# Altium schematic sheet Power_Supply.SchDoc
size A4; SheetNumber: 5; SheetTotal: 5
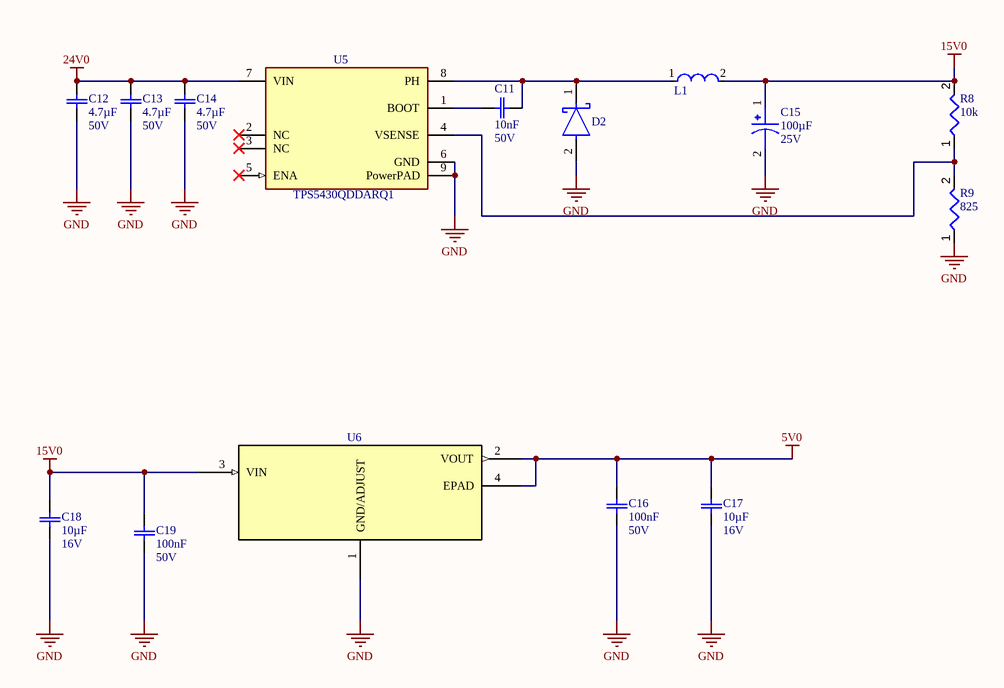
[diagram p0: Power_Supply.SchDoc]

## Parts
C11  value 10nF  Voltage Rating: 50V  [Generic Ceramic 0603 CAP]  (hidden comment: CAP-MLCC_SMD-0603_MR-GCM_n_10nF_50V_10%_COG)
C12  value 4.7µF  Voltage Rating: 50V  [Generic Ceramic 0805 CAP]  (hidden comment: CAP-MLCC_SMD-0805_TDK-CGA_u_4.7uF_V_10%_X8R)
C13  value 4.7µF  Voltage Rating: 50V  [Generic Ceramic 0805 CAP]  (hidden comment: CAP-MLCC_SMD-0805_TDK-CGA_u_4.7uF_V_10%_X8R)
C14  value 4.7µF  Voltage Rating: 50V  [Generic Ceramic 0805 CAP]  (hidden comment: CAP-MLCC_SMD-0805_TDK-CGA_u_4.7uF_V_10%_X8R)
C15  value 100µF  Voltage Rating: 25V  [FP-FKE-MFG]  (hidden comment: CAP_ELEC_SMD_PNS__EEE_u_100uF_25V_20%)
C16  value 100nF  Voltage Rating: 50V  [Generic Ceramic 0603 CAP]  (hidden comment: CAP-MLCC_SMD-0603_MR-GCM_u_0.1uF_50V_10%_X8L)
C17  value 10µF  Voltage Rating: 16V  [Generic Ceramic 0805 CAP]  (hidden comment: CAP-MLCC_SMD-0805_TDK-CGA_u_10uF_16V_20%_X7S)
C18  value 10µF  Voltage Rating: 16V  [Generic Ceramic 0805 CAP]  (hidden comment: CAP-MLCC_SMD-0805_TDK-CGA_u_10uF_16V_20%_X7S)
C19  value 100nF  Voltage Rating: 50V  [Generic Ceramic 0603 CAP]  (hidden comment: CAP-MLCC_SMD-0603_MR-GCM_u_0.1uF_50V_10%_X8L)
D2  MBRA340T3G  [ONSC-SMA-2-403D-02_F_V]  (value not drawn)
L1  SRR1260-150M  [FP-SRR1260-MFG]  (value not drawn)
R8  value 10k  [Generic_0603_RES]  (hidden comment: RES-TK_SMD-0603_VIS-CRCW_K_10K_1/10W_1%)
R9  value 825  [Generic_0603_RES]  (hidden comment: RES-TK_SMD-0603_VIS-CRCW_R_825R_1/10W_1%)
U5  TPS5430QDDARQ1  [FP-DDA0008J-IPC_B]
U6  AMS1117-5.0  [AMS1117-3.3-Footprint-1]  (value not drawn)

## Nets
5V0: C16.2 C17.2 U6.2(VOUT) U6.4(EPAD)
15V0: C15.1 C18.2 C19.2 L1.2 R8.2 U6.3(VIN)
24V0: C12.2 C13.2 C14.2 U5.7(VIN)
GND: C12.1 C13.1 C14.1 C15.2 C16.1 C17.1 C18.1 C19.1 D2.2(A) R9.1 U5.6(GND) U5.9(PowerPAD) U6.1(GND/ADJUST)
NetC11_1: C11.1 D2.1(C) L1.1 U5.8(PH)
NetC11_2: C11.2 U5.1(BOOT)
NetR8_1: R8.1 R9.2 U5.4(VSENSE)

Not connected (* = marked no-connect by the designer): U5 2(NC)* 3(NC)* 5(ENA)*

## Library data of the parts
C11 = CMP-001-00163-2: Ceramic Capacitor, Multilayer, Ceramic, 50V, 5% +Tol, 5% -Tol, C0G, 30ppm/Cel TC, 0.01uF, Surface Mount, 0603; Dielectric: COG; Max Operating Temperature: 125°C; Min Operating Temperature: -55°C; Mounting Technology: Surface Mount; Automotive: AEQ-200; Case/Package: 0603; RoHS Compliant: Yes; Capacitor Type: Ceramic; Pins: 2
C12-C14 = CMP-001-00158-2: Ceramic Capacitor, Multilayer, Ceramic, 50V, 10% +Tol, 10% -Tol, X5R, 15% TC, 4.7uF, Surface Mount, 0805; Tolerance: 10%; Max Operating Temperature: 85°C; Case/Package: 0805; RoHS Compliant: Yes; Automotive: AEQ-Q200; Mounting Technology: Surface Mount; Capacitor Type: Ceramic; Pins: 2; Dielectric: x5r; Min Operating Temperature: -55°C
C15 = CMP-001-00185-2: Aluminum Electrolytic Capacitor, Polarized, Aluminum (wet), 25V, 20% +Tol, 20% -Tol, 100uF, Surface Mount, 3333; Manufacturer Part Number: EEE-FK1H101GP; Ripple Current: 225mA; Capacitor Type: Aluminium; Case/Package: 3333; Min Operating Temperature: -55°C; Mounting Technology: Surface Mount; RoHS Compliant: Yes; Pins: 2; Max Operating Temperature: 105°C
C16 C19 = CMP-001-00115-11: Ceramic Capacitor, Multilayer, Ceramic, 50V, 10% +Tol, 10% -Tol, X8L, -40/+15% TC, 0.1uF, Surface Mount, 0603; Automotive: AEQ-200; Min Operating Temperature: -55°C; Case/Package: 0603; Mounting Technology: Surface Mount; RoHS Compliant: Yes; Capacitor Type: Ceramic; Pins: 2; Max Operating Temperature: 150°C
C17 C18 = CMP-001-00173-2: Ceramic Capacitor, Multilayer, Ceramic, 16V, 20% +Tol, 20% -Tol, X7S, 22% TC, 10uF, Surface Mount, 0805; RoHS Compliant: Yes; Capacitor Type: Ceramic; Tolerance: 20%; Pins: 2; Mounting Technology: SMD; Case/Package: 0805; Automotive: AEQ-Q200; Dielectric: X7S
D2 = CMP-001-0146-1: Diode, Schottky Barrier, Vr 40V, If 3A, Pkg SMA, Vf 0.45V, Tj +150degc, Cs 100A, Ir 15mA; Manufacturer Lifecycle Status: ACTIVE; Max Junction Temperature (Tj): 150°C; Number of Elements: 1; Forward Voltage: 450mV; Polarity: Standard; Peak Reverse Current: 300µA; Element Configuration: Single; REACH SVHC: No; Number of Terminals: 2; Width: 2.6mm; Min Operating Temperature: -55°C; Voltage Rating (DC): 40V; Reverse Standoff Voltage: 40V; Max Repetitive Reverse Voltage (Vrrm): 40V; Lifecycle Status: Production; Reverse Voltage: 40V; Output Current: 3A; Pins: 2; Lead Free: Lead Free; Max Reverse Voltage (DC): 40V; Max Forward Surge Current (Ifsm): 100A; Forward Current: 3A; Current Rating: 3A; Length: 4.32mm; Average Rectified Current: 3A; Radiation Hardening: No; Packaging: Tape and Reel; Max Operating Temperature: 150°C; Halogen Free: Halogen Free; China RoHS: Non-Compliant; Case/Package: SMA; RoHS: Compliant; Height: 2.2mm; Schedule B: 8541100080; Max Output current: 3A; Peak Non-Repetitive Surge Current: 100A
L1 = CMP-2000-07146-2: FIXED IND 15UH 5A 27 MOHM SMD; Q Factor: 25; Sample Rate (Hz): 100kHz; Resistance: 27MR; Material: Steel; Inductance Tolerance: 20%; Frequency: 17.6MHz; Saturation Current: 4.6A; Core Material: Ferrite; Shielding: Shielded; Series: SRR1260; Termination: SMD/SMT; Packaging: Tape and Reel; RoHS Compliant: Yes; Height - Seated (Max): 0.256inch; Depth: 12.8mm; Case/Package: 1260; Inductance: 15uH; Height: 6mm; Number of Pins: 2; Mount: Surface Mount; Min Operating Temperature: -40°C; Test Frequency: 100kHz; Length: 12.5mm; Self Resonant Frequency: 17.6MHz; Current Rating: 5A; Tolerance: 20%; RMS Current (Irms): 5A; REACH SVHC: No SVHC; Resistor Type: Wirewound; DC Resistance (DCR): 27mR; Width: 12.5mm; Package Quantity: 600; DC Current: 5A; Max DC Current: 5A; Max Operating Temperature: 125°C; Military Standard: Not
R8 = CMP-009-00231-2: Fixed Resistor, Metal Glaze/thick Film, 0.1W, 10000ohm, 75V, 1% +/-Tol, 100ppm/Cel, Surface Mount, 0603; Power: 100mW; Min Operating Temperature: -55°C; Case/Package: 0603; Max Operating Temperature: 155°C; RoHS Compliant: Yes; Voltage Rating: 75V; Tolerance: 1%; Pins: 2; Mounting Technology: Surface Mount
R9 = CMP-009-00203-6: Fixed Resistor, Metal Glaze/thick Film, 0.1W, 825ohm, 75V, 1% +/-Tol, 100ppm/Cel, Surface Mount, 0603; Power: 100mW; Case/Package: 0603; Min Operating Temperature: -55°C; Voltage Rating: 75V; Tolerance: 1%; Mounting Technology: Surface Mount; Pins: 2; Max Operating Temperature: 155°C; RoHS Compliant: Yes
U5 = CMP-001-0169-1: Automotive 5.5V to 36V, 500kHz Fixed Frequency 3A Buck Converter 8-SO PowerPAD -40 to 125; Manufacturer Lifecycle Status: ACTIVE; Output Voltage: 1.221V; Output Type: Adjustable; Quiescent Current: 3mA; Number of Outputs: 1; Max Duty Cycle: 89%; Efficiency: 95%; Max Output Voltage: 31V; Min Output Voltage: 1.22V; Max Junction Temperature (Tj): 125°C; Synchronous Rectifier: No; Pins: 8; Length: 4.89mm; REACH SVHC: No; Height: 1.7mm; Mounting Technology: Surface Mount; Radiation Hardening: No; Thickness: 1.48mm; Width: 3.9mm; Output Current: 3A; Lead Free: Lead Free; Min Input Voltage: 5.5V; Switching Frequency: 500kHz; Nominal Supply Current: 3mA; Topology: Buck; Min Supply Voltage: 5.5V; Operating Supply Voltage: 36V; RoHS: Compliant; Max Supply Voltage: 36V; Max Output current: 3A; Weight: 70.590313mg; Min Operating Temperature: -40°C; Max Operating Temperature: 125°C; Lifecycle Status: Production
U6 = CMP-001-0174-1: LDO Regulator Pos 5V 1A 4-Pin(3+Tab) SOT-223 / 1A LOW DROPOUT VOLTAGE REGULATOR; Max Power Dissipation: 1.2W; Max Junction Temperature (Tj): 125°C; Max Supply Voltage: 15V; Dropout Voltage: 1.1V; Number of Outputs: 1; Nominal Supply Current: 5mA; Min Operating Temperature: -40°C; RoHS: Compliant; REACH SVHC: Yes; Case/Package: SOT-223; Output Current: 1A; Pins: 2; Max Operating Temperature: 125°C; Height: 1.8mm; Output Voltage: 5V